# EAGLE schematic TTGO_shield_revB (EAGLE 9.0.1)
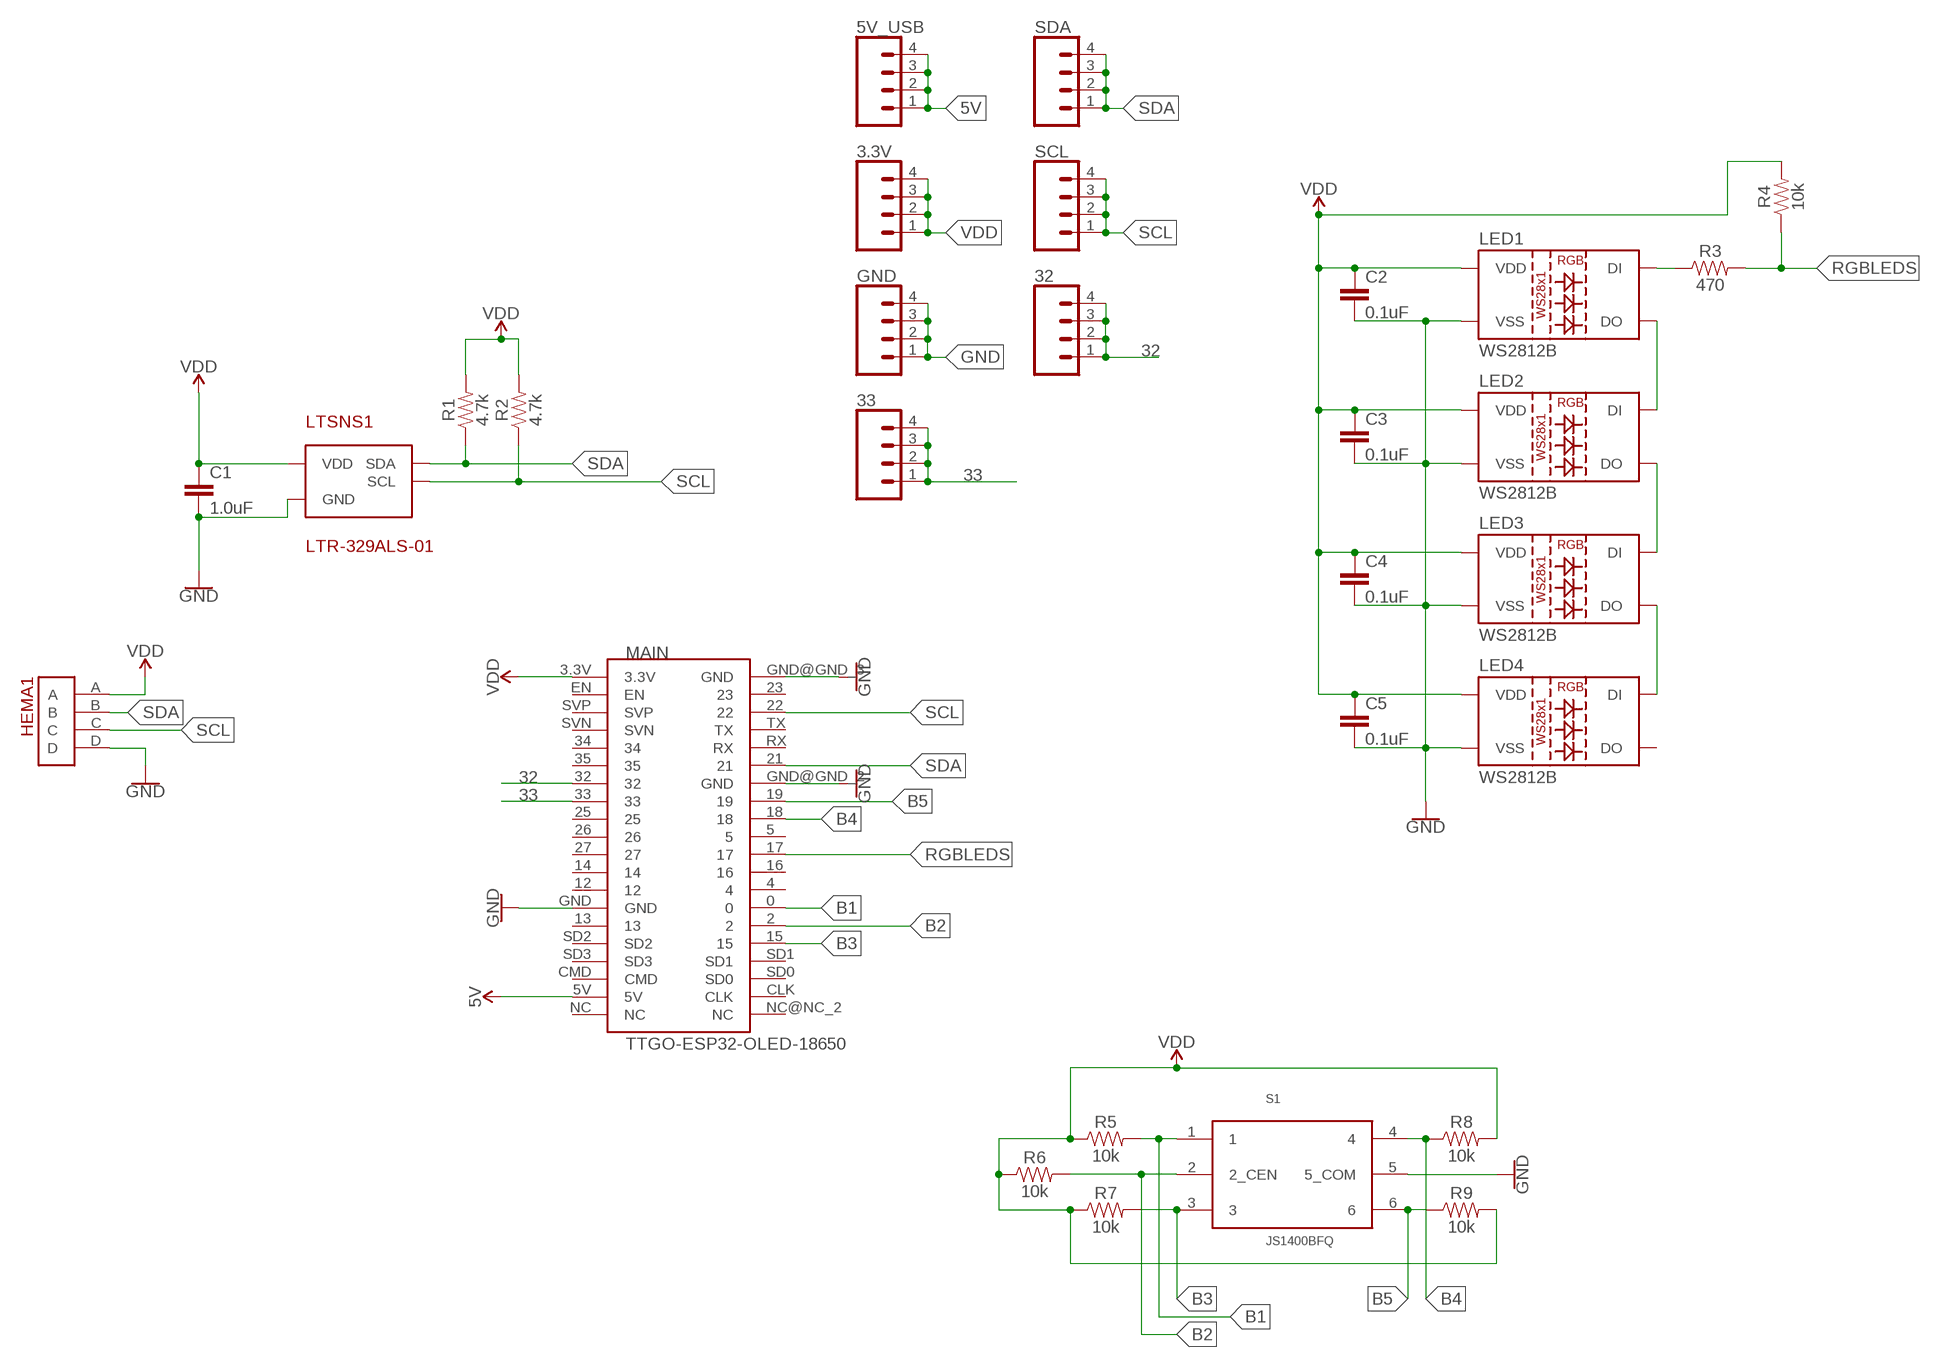
[diagram p0: schematic, sheet 1]

## Parts
3.3V  CONN_041X04_NO_SILK  [1X04_NO_SILK]
5V_USB  CONN_041X04_NO_SILK  [1X04_NO_SILK]
32  CONN_041X04_NO_SILK  [1X04_NO_SILK]
33  CONN_041X04_NO_SILK  [1X04_NO_SILK]
C1  1.0uF  1.0UF-0805-25V-10%  [0805]
C2  0.1uF  0.1UF-0603-25V-5%  [0603]
C3  0.1uF  0.1UF-0603-25V-5%  [0603]
C4  0.1uF  0.1UF-0603-25V-5%  [0603]
C5  0.1uF  0.1UF-0603-25V-5%  [0603]
GND  CONN_041X04_NO_SILK  [1X04_NO_SILK]
HEMA1  10120045-400LF  [10120045-400LF]
LED1  WS2812B  [WS2812B]
LED2  WS2812B  [WS2812B]
LED3  WS2812B  [WS2812B]
LED4  WS2812B  [WS2812B]
LTSNS1  LTR-329ALS-01  [CHIPLED-4]
MAIN  TTGO-ESP32-OLED-18650  [TTGO-ESP32-OLED-18650]
R1  4.7k  4.7KOHM-0603-1/10W-1%  [0603]
R2  4.7k  4.7KOHM-0603-1/10W-1%  [0603]
R3  470  470OHM-0603-1/10W-1%  [0603]
R4  10k  10KOHM-0603-1/10W-1%  [0603]
R5  10k  10KOHM-0603-1/10W-1%  [0603]
R6  10k  10KOHM-0603-1/10W-1%  [0603]
R7  10k  10KOHM-0603-1/10W-1%  [0603]
R8  10k  10KOHM-0603-1/10W-1%  [0603]
R9  10k  10KOHM-0603-1/10W-1%  [0603]
S1  JS1400BFQ  [JS1400BFQ]
SCL  CONN_041X04_NO_SILK  [1X04_NO_SILK]
SDA  CONN_041X04_NO_SILK  [1X04_NO_SILK]

## Nets
5V: 5V_USB.1 5V_USB.2 5V_USB.3 5V_USB.4 MAIN.5V
32: 32.1 32.2 32.3 32.4 MAIN.32
33: 33.1 33.2 33.3 33.4 MAIN.33
B1: MAIN.0 R5.2 S1.1
B2: MAIN.2 R6.2 S1.2(2_CEN)
B3: MAIN.15 R7.2 S1.3
B4: MAIN.18 R8.1 S1.4
B5: MAIN.19 R9.1 S1.6
GND: C1.2 C2.2 C3.2 C4.2 C5.2 GND.1 GND.2 GND.3 GND.4 HEMA1.D LED1.3(VSS) LED2.3(VSS) LED3.3(VSS) LED4.3(VSS) LTSNS1.2(GND) MAIN.GND MAIN.GND@GND_2(GND) MAIN.GND@GND_3(GND) S1.5(5_COM)
N$9: LED1.2(DO) LED2.4(DI)
N$10: LED2.2(DO) LED3.4(DI)
N$11: LED3.2(DO) LED4.4(DI)
N$12: LED1.4(DI) R3.1
RGBLEDS: MAIN.17 R3.2 R4.1
SCL: HEMA1.C LTSNS1.4(SCL) MAIN.22 R2.1 SCL.1 SCL.2 SCL.3 SCL.4
SDA: HEMA1.B LTSNS1.3(SDA) MAIN.21 R1.1 SDA.1 SDA.2 SDA.3 SDA.4
VDD: 3.3V.1 3.3V.2 3.3V.3 3.3V.4 C1.1 C2.1 C3.1 C4.1 C5.1 HEMA1.A LED1.1(VDD) LED2.1(VDD) LED3.1(VDD) LED4.1(VDD) LTSNS1.1(VDD) MAIN.3.3V R1.2 R2.2 R4.2 R5.1 R6.1 R7.1 R8.2 R9.2
Unconnected: LED4.2(DO) MAIN.4 MAIN.5 MAIN.12 MAIN.13 MAIN.14 MAIN.16 MAIN.23 MAIN.25 MAIN.26 MAIN.27 MAIN.34 MAIN.35 MAIN.CLK MAIN.CMD MAIN.EN MAIN.NC MAIN.NC@NC_2(NC) MAIN.RX MAIN.SD0 MAIN.SD1 MAIN.SD2 MAIN.SD3 MAIN.SVN MAIN.SVP MAIN.TX

## Library data of the parts
3.3V 5V_USB 32 33 GND SCL SDA = SparkFun-Connectors:CONN_04: Multi connection point. Often used as Generic Header-pin footprint for 0.1 inch spaced/style header connections On any of the 0.1 inch spaced packages, you can populate with these: Break Away Headers - Straight <https://www.sparkfun.com/products/116> (PRT-00116) Break Away Male Headers - Right Angle <https://www.sparkfun.com/products/553> (PRT-00553) Female Headers <https://www.sparkfun.com/products/115> (PRT-00115) Break Away Headers - Machine Pin <https://www.sparkfun.com/products/117> (PRT-00117) Break Away Female Headers - Swiss Machine Pin <https://www.sparkfun.com/products/743> (PRT-00743) For SCREWTERMINALS and SPRING TERMINALS visit here: Screw Terimnals on SparkFun.com <https://www.sparkfun.com/search/results?term=Screw+Terminals> (5mm/3.5mm/2.54mm spacing) This device is also useful as a general connection point to wire up your design to another part of your project. Our various solder wires solder well into these plated through hole pads. Hook-Up Wire - Assortment (Stranded, 22 AWG) <https://www.sparkfun.com/products/11375> (PRT-11375) Hook-Up Wire - Assortment (Solid Core, 22 AWG) <https://www.sparkfun.com/products/11367> (PRT-11367) View the entire wire category on our website here <https://www.sparkfun.com/categories/141> Special notes: Molex polarized connector foot print use with SKU : PRT-08231 with associated crimp pins and housings. 1MM SMD Version SKU: PRT-10208; PROD_ID: CONN-09696
C1 = SparkFun-Capacitors:1.0UF: 1µF ceramic capacitors A capacitor is a passive two-terminal electrical component used to store electrical energy temporarily in an electric field.; PROD_ID: CAP-08064
C2-C5 = SparkFun-Capacitors:0.1UF: 0.1µF ceramic capacitors A capacitor is a passive two-terminal electrical component used to store electrical energy temporarily in an electric field.; PROD_ID: CAP-08604
HEMA1 = BadgeParts:10120045-400LF: SSL Connector 4 Position Blade and Receptacle, Hermaphroditic Board to Board 0.118" (3.00mm) Solder Datasheet <https://cdn.amphenol-icc.com/media/wysiwyg/files/drawing/10120045-400lf.pdf>
LED1-LED4 = SparkFun-LED:WS2812B: WS2812B SMD addressable RGB LED 5x5mm SMD LED with built-in controller IC. Color: Red/Green/Blue mC Rating: RGB: 390, 660, 180 mcd Forward Voltage: RGB: 2.0, 3.0, 3.0 V Packages:WS2812B SparkFun Products: Blynk Board - ESP8266 <https://www.sparkfun.com/products/13794>; PROD_ID: DIO-12503
LTSNS1 = NickParts:LTR-329ALS-01
MAIN = BadgeParts:TTGO-ESP32-OLED-18650
R1 R2 = SparkFun-Resistors:4.7KOHM: 4.7kΩ resistor A resistor is a passive two-terminal electrical component that implements electrical resistance as a circuit element. Resistors act to reduce current flow, and, at the same time, act to lower voltage levels within circuits. - Wikipedia; PROD_ID: RES-07857
R3 = SparkFun-Resistors:470OHM: 470Ω resistor A resistor is a passive two-terminal electrical component that implements electrical resistance as a circuit element. Resistors act to reduce current flow, and, at the same time, act to lower voltage levels within circuits. - Wikipedia; PROD_ID: RES-07869
R4-R9 = SparkFun-Resistors:10KOHM: 10kΩ resistor A resistor is a passive two-terminal electrical component that implements electrical resistance as a circuit element. Resistors act to reduce current flow, and, at the same time, act to lower voltage levels within circuits. - Wikipedia; PROD_ID: RES-00824
S1 = BadgeParts:JS1400BFQ: 5-way SMD tactile switch